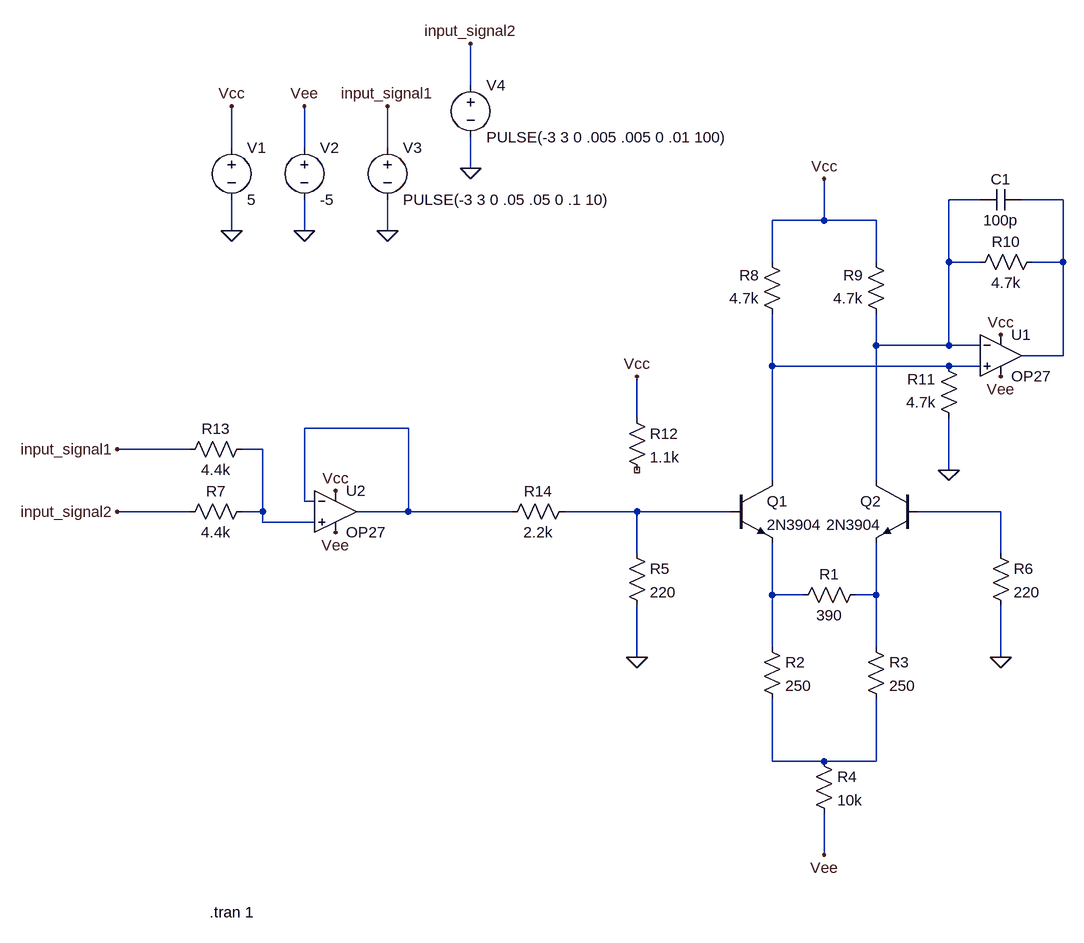
[diagram p0: schematic sineshaper.asc]
sineshaper.asc, the LTspice schematic file:
Version 4
SHEET 1 880 776
WIRE -320 -512 -320 -576
WIRE -688 -416 -688 -480
WIRE -576 -416 -576 -480
WIRE -448 -416 -448 -480
WIRE -320 -384 -320 -432
WIRE 464 -336 416 -336
WIRE 592 -336 528 -336
WIRE 224 -304 224 -368
WIRE 224 -304 144 -304
WIRE 304 -304 224 -304
WIRE -688 -288 -688 -336
WIRE -576 -288 -576 -336
WIRE -448 -288 -448 -336
WIRE 144 -240 144 -304
WIRE 304 -240 304 -304
WIRE 416 -240 416 -336
WIRE 464 -240 416 -240
WIRE 592 -240 592 -336
WIRE 592 -240 544 -240
WIRE 304 -112 304 -160
WIRE 416 -112 416 -240
WIRE 416 -112 304 -112
WIRE 464 -112 416 -112
WIRE 592 -96 592 -240
WIRE 592 -96 528 -96
WIRE 144 -80 144 -160
WIRE 416 -80 144 -80
WIRE 464 -80 416 -80
WIRE -64 0 -64 -64
WIRE -416 16 -576 16
WIRE -752 48 -864 48
WIRE -640 48 -672 48
WIRE 416 80 416 0
WIRE 144 96 144 -80
WIRE 304 96 304 -112
WIRE -576 128 -576 16
WIRE -560 128 -576 128
WIRE -752 144 -864 144
WIRE -640 144 -640 48
WIRE -640 144 -672 144
WIRE -416 144 -416 16
WIRE -416 144 -496 144
WIRE -256 144 -416 144
WIRE -64 144 -176 144
WIRE 80 144 -64 144
WIRE 496 144 368 144
WIRE -640 160 -640 144
WIRE -560 160 -640 160
WIRE -64 208 -64 144
WIRE 496 208 496 144
WIRE 144 272 144 192
WIRE 192 272 144 272
WIRE 304 272 304 192
WIRE 304 272 272 272
WIRE 144 352 144 272
WIRE 304 352 304 272
WIRE -64 368 -64 288
WIRE 496 368 496 288
WIRE 144 528 144 432
WIRE 224 528 144 528
WIRE 304 528 304 432
WIRE 304 528 224 528
WIRE 224 672 224 608
FLAG -64 368 0
FLAG 496 368 0
FLAG -688 -288 0
FLAG -576 -288 0
FLAG -448 -288 0
FLAG 224 -368 Vcc
FLAG -576 -480 Vee
FLAG -448 -480 input_signal1
FLAG -688 -480 Vcc
FLAG 224 672 Vee
FLAG -864 144 input_signal2
FLAG 496 -128 Vcc
FLAG 496 -64 Vee
FLAG 416 80 0
FLAG -64 -64 Vcc
FLAG -320 -384 0
FLAG -320 -576 input_signal2
FLAG -864 48 input_signal1
FLAG -528 112 Vcc
FLAG -528 176 Vee
SYMBOL npn 80 96 R0
SYMATTR InstName Q1
SYMATTR Value 2N3904
SYMBOL npn 368 96 M0
SYMATTR InstName Q2
SYMATTR Value 2N3904
SYMBOL res 288 256 R90
WINDOW 0 0 56 VBottom 2
WINDOW 3 32 56 VTop 2
SYMATTR InstName R1
SYMATTR Value 390
SYMBOL res 128 336 R0
SYMATTR InstName R2
SYMATTR Value 250
SYMBOL res 288 336 R0
SYMATTR InstName R3
SYMATTR Value 250
SYMBOL res 208 512 R0
SYMATTR InstName R4
SYMATTR Value 10k
SYMBOL res -80 192 R0
SYMATTR InstName R5
SYMATTR Value 220
SYMBOL res 480 192 R0
SYMATTR InstName R6
SYMATTR Value 220
SYMBOL res -656 128 R90
WINDOW 0 0 56 VBottom 2
WINDOW 3 32 56 VTop 2
SYMATTR InstName R7
SYMATTR Value 4.4k
SYMBOL res 160 -144 R180
WINDOW 0 36 76 Left 2
WINDOW 3 36 40 Left 2
SYMATTR InstName R8
SYMATTR Value 4.7k
SYMBOL res 320 -144 R180
WINDOW 0 36 76 Left 2
WINDOW 3 36 40 Left 2
SYMATTR InstName R9
SYMATTR Value 4.7k
SYMBOL voltage -688 -432 R0
WINDOW 123 0 0 Left 0
WINDOW 39 0 0 Left 0
SYMATTR InstName V1
SYMATTR Value 5
SYMBOL voltage -576 -432 R0
WINDOW 123 0 0 Left 0
WINDOW 39 0 0 Left 0
SYMATTR InstName V2
SYMATTR Value -5
SYMBOL voltage -448 -432 R0
WINDOW 123 0 0 Left 0
WINDOW 39 0 0 Left 0
SYMATTR InstName V3
SYMATTR Value PULSE(-3 3 0 .05 .05 0 .1 10)
SYMBOL OpAmps\\OP27 496 -160 R0
SYMATTR InstName U1
SYMBOL res 560 -256 R90
WINDOW 0 0 56 VBottom 2
WINDOW 3 32 56 VTop 2
SYMATTR InstName R10
SYMATTR Value 4.7k
SYMBOL cap 528 -352 R90
WINDOW 0 0 32 VBottom 2
WINDOW 3 32 32 VTop 2
SYMATTR InstName C1
SYMATTR Value 100p
SYMBOL res 432 16 R180
WINDOW 0 36 76 Left 2
WINDOW 3 36 40 Left 2
SYMATTR InstName R11
SYMATTR Value 4.7k
SYMBOL res -80 -16 R0
SYMATTR InstName R12
SYMATTR Value 1.1k
SYMBOL voltage -320 -528 R0
WINDOW 123 0 0 Left 0
WINDOW 39 0 0 Left 0
SYMATTR InstName V4
SYMATTR Value PULSE(-3 3 0 .005 .005 0 .01 100)
SYMBOL res -656 32 R90
WINDOW 0 0 56 VBottom 2
WINDOW 3 32 56 VTop 2
SYMATTR InstName R13
SYMATTR Value 4.4k
SYMBOL OpAmps\\OP27 -528 80 R0
SYMATTR InstName U2
SYMBOL res -160 128 R90
WINDOW 0 0 56 VBottom 2
WINDOW 3 32 56 VTop 2
SYMATTR InstName R14
SYMATTR Value 2.2k
TEXT -722 760 Left 2 !.tran 1

The netlist it stands for:
* sineshaper.asc
Q1 N003 N006 N008 0 2N3904
Q2 N001 N007 N009 0 2N3904
R1 N009 N008 390
R2 N008 N010 250
R3 N009 N010 250
R4 N010 Vee 10k
R5 N006 0 220
R6 N007 0 220
R7 N005 input_signal2 4.4k
R8 N003 Vcc 4.7k
R9 N001 Vcc 4.7k
V1 Vcc 0 5
V2 Vee 0 -5
V3 input_signal1 0 PULSE(-3 3 0 .05 .05 0 .1 10)
XU1 N003 N001 Vcc Vee N002 OP27  ; pins In+ In- V+ V- OUT
R10 N002 N001 4.7k
C1 N002 N001 100p
R11 0 N003 4.7k
R12 Vcc NC_01 1.1k
V4 input_signal2 0 PULSE(-3 3 0 .005 .005 0 .01 100)
R13 N005 input_signal1 4.4k
XU2 N005 N004 Vcc Vee N004 OP27  ; pins In+ In- V+ V- OUT
R14 N006 N004 2.2k
.model NPN NPN
.model PNP PNP
.lib standard.bjt
.tran 1
.lib ADI.lib
.backanno
.end